# Altium schematic sheet Strathim MCU Pin Plan.SchDoc
size A3
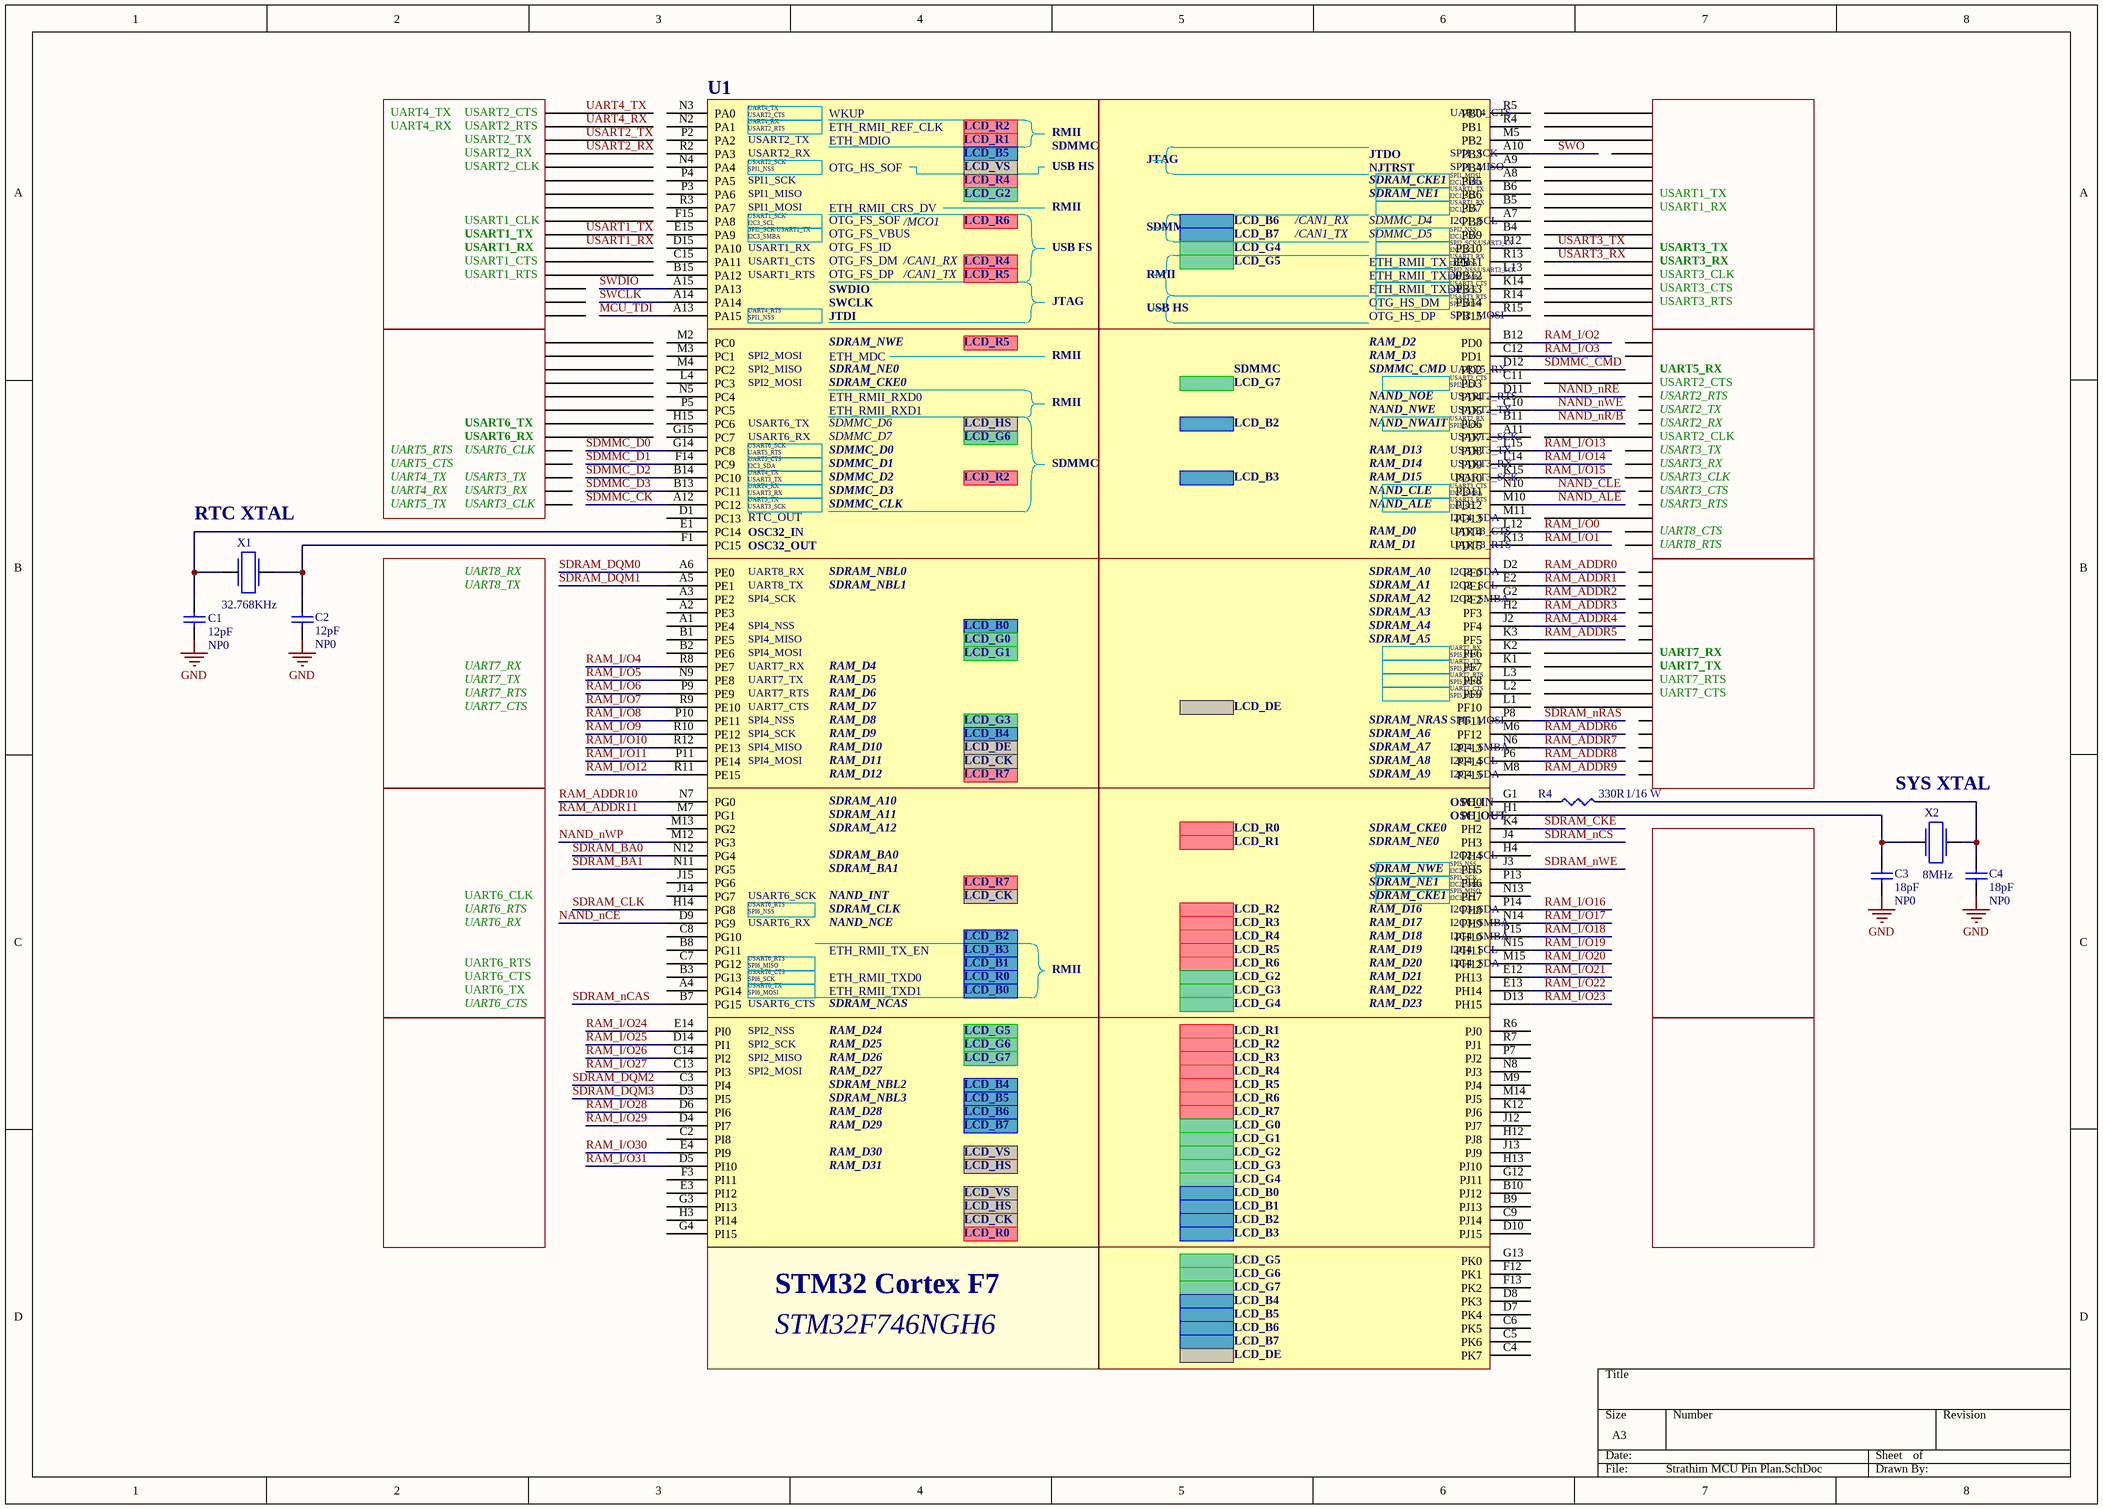
[diagram p0: Strathim MCU Pin Plan.SchDoc]

## Parts
C1  value 12pF  Type: NP0  [CAP0402]  (hidden comment: ChipCap 12 NP0)
C2  value 12pF  Type: NP0  [CAP0402]  (hidden comment: ChipCap 12 NP0)
C3  value 18pF  Type: NP0  [CAP0402]  (hidden comment: ChipCap 18 NP0)
C4  value 18pF  Type: NP0  [CAP0402]  (hidden comment: ChipCap 18 NP0)
R4  value 330R  Rating: 1/16 W  [RES0402]  (hidden comment: RES0402 330R 1%)
U1  STM32F746NGH6  [TFBGA216]  (value not drawn)  (parts A,B,C,D,E,F,G,H,I,J,K of 12)
X1  value 32.768KHz  [KX-327NHT]  (hidden comment: XTAL)
X2  value 8MHz  [ABM3 Ceramic Crystal]  (hidden comment: XTAL)

## Nets
GND: C1.1 C2.1 C3.1 C4.1
MCU_TDI: U1.A13(PA15)
NAND_ALE: U1.M10(PD12)
NAND_CLE: U1.N10(PD11)
NAND_nCE: U1.D9(PG9)
NAND_nR/B: U1.B11(PD6)
NAND_nRE: U1.D11(PD4)
NAND_nWE: U1.C10(PD5)
NAND_nWP: U1.M12(PG3)
RAM_ADDR0: U1.D2(PF0)
RAM_ADDR1: U1.E2(PF1)
RAM_ADDR2: U1.G2(PF2)
RAM_ADDR3: U1.H2(PF3)
RAM_ADDR4: U1.J2(PF4)
RAM_ADDR5: U1.K3(PF5)
RAM_ADDR6: U1.M6(PF12)
RAM_ADDR7: U1.N6(PF13)
RAM_ADDR8: U1.P6(PF14)
RAM_ADDR9: U1.M8(PF15)
RAM_ADDR10: U1.N7(PG0)
RAM_ADDR11: U1.M7(PG1)
RAM_I/O0: U1.L12(PD14)
RAM_I/O1: U1.K13(PD15)
RAM_I/O2: U1.B12(PD0)
RAM_I/O3: U1.C12(PD1)
RAM_I/O4: U1.R8(PE7)
RAM_I/O5: U1.N9(PE8)
RAM_I/O6: U1.P9(PE9)
RAM_I/O7: U1.R9(PE10)
RAM_I/O8: U1.P10(PE11)
RAM_I/O9: U1.R10(PE12)
RAM_I/O10: U1.R12(PE13)
RAM_I/O11: U1.P11(PE14)
RAM_I/O12: U1.R11(PE15)
RAM_I/O13: U1.L15(PD8)
RAM_I/O14: U1.L14(PD9)
RAM_I/O15: U1.K15(PD10)
RAM_I/O16: U1.P14(PH8)
RAM_I/O17: U1.N14(PH9)
RAM_I/O18: U1.P15(PH10)
RAM_I/O19: U1.N15(PH11)
RAM_I/O20: U1.M15(PH12)
RAM_I/O21: U1.E12(PH13)
RAM_I/O22: U1.E13(PH14)
RAM_I/O23: U1.D13(PH15)
RAM_I/O24: U1.E14(PI0)
RAM_I/O25: U1.D14(PI1)
RAM_I/O26: U1.C14(PI2)
RAM_I/O27: U1.C13(PI3)
RAM_I/O28: U1.D6(PI6)
RAM_I/O29: U1.D4(PI7)
RAM_I/O30: U1.E4(PI9)
RAM_I/O31: U1.D5(PI10)
SDMMC_CK: U1.A12(PC12)
SDMMC_CMD: U1.D12(PD2)
SDMMC_D0: U1.G14(PC8)
SDMMC_D1: U1.F14(PC9)
SDMMC_D2: U1.B14(PC10)
SDMMC_D3: U1.B13(PC11)
SDRAM_BA0: U1.N12(PG4)
SDRAM_BA1: U1.N11(PG5)
SDRAM_CKE: U1.K4(PH2)
SDRAM_CLK: U1.H14(PG8)
SDRAM_DQM0: U1.A6(PE0)
SDRAM_DQM1: U1.A5(PE1)
SDRAM_DQM2: U1.C3(PI4)
SDRAM_DQM3: U1.D3(PI5)
SDRAM_nCAS: U1.B7(PG15)
SDRAM_nCS: U1.J4(PH3)
SDRAM_nRAS: U1.P8(PF11)
SDRAM_nWE: U1.J3(PH5)
SWCLK: U1.A14(PA14)
SWDIO: U1.A15(PA13)
SWO: U1.A10(PB3)
NetC1_2: C1.2 U1.E1(PC14) X1.1
NetC2_2: C2.2 U1.F1(PC15) X1.2
NetC3_2: C3.2 U1.H1(PH1) X2.1
NetC4_2: C4.2 R4.2 X2.2
NetR4_1: R4.1 U1.G1(PH0)

Not connected (* = marked no-connect by the designer): U1 A1(PE4) A2(PE3) A3(PE2) A4(PG14) A7(PB8) A8(PB5) A9(PB4) A11(PD7) B1(PE5) B2(PE6) B3(PG13) B4(PB9) B5(PB7) B6(PB6) B8(PG11) B9(PJ13) B10(PJ12) B15(PA12) C2(PI8) C4(PK7) C5(PK6) C6(PK5) C7(PG12) C8(PG10) C9(PJ14) C11(PD3) C15(PA11) D1(PC13) D7(PK4) D8(PK3) D10(PJ15) D15(PA10) E3(PI12) E15(PA9) F3(PI11) F12(PK1) F13(PK2) F15(PA8) G3(PI13) G4(PI15) G12(PJ11) G13(PK0) G15(PC7) H3(PI14) H4(PH4) H12(PJ8) H13(PJ10) H15(PC6) J12(PJ7) J13(PJ9) J14(PG7) J15(PG6) K1(PF7) K2(PF6) K12(PJ6) K14(PB13) L1(PF10) L2(PF9) L3(PF8) L4(PC3) L13(PB12) M2(PC0) M3(PC1) M4(PC2) M5(PB2) M9(PJ4) M11(PD13) M13(PG2) M14(PJ5) N2(PA1) N3(PA0) N4(PA4) N5(PC4) N8(PJ3) N13(PH7) P2(PA2) P3(PA6) P4(PA5) P5(PC5) P7(PJ2) P12(PB10) P13(PH6) R2(PA3) R3(PA7) R4(PB1) R5(PB0) R6(PJ0) R7(PJ1) R13(PB11) R14(PB14) R15(PB15)

## Notes on the sheet
- (near U1) U1
- UART4_TX
- UART4_RX
- USART2_RTS
- USART2_CTS
- USART2_TX
- USART2_RX
- USART2_CLK
- USART1_CLK
- USART1_TX
- USART1_RX
- USART1_RTS
- USART1_CTS
- USART3_TX
- USART3_RX
- USART3_CLK
- USART3_CTS
- USART3_RTS
- UART5_RX
- UART5_RTS
- USART6_TX
- USART6_RX
- USART6_CLK
- UART5_TX
- UART5_CTS
- (near X1) RTC XTAL
- UART8_RX
- UART8_TX
- UART8_CTS
- UART8_RTS
- UART7_RX
- UART7_TX
- UART7_RTS
- UART7_CTS
- SYS XTAL
- UART6_RTS
- UART6_CLK
- UART6_RX
- UART6_CTS
- UART6_TX
- STM32 Cortex F7
- STM32F746NGH6
- Labels drawn without touching a wire or pin: UART4_RX, UART4_TX, USART1_RX, USART1_TX, USART2_RX, USART2_TX, USART3_RX, USART3_TX
- (in symbol STM32F746NGH6, part A) UART4_TX; WKUP; USART2_CTS; UART4_RX; ETH_RMII_REF_CLK; USART2_RTS; LCD_R2; ETH_MDIO; RMII; USART2_TX; LCD_R1; SDMMC; USART2_RX; LCD_B5; USART2_SCK; OTG_HS_SOF; SPI1_NSS; LCD_VS; USB HS; SPI1_SCK; LCD_R4; SPI1_MISO; LCD_G2; ETH_RMII_CRS_DV; SPI1_MOSI; USART1_SCK; /MCO1; I2C3_SCL; OTG_FS_SOF; LCD_R6; SPI2_SCK/USART1_TX; I2C3_SMBA; OTG_FS_VBUS; USART1_RX; OTG_FS_ID; USB FS; USART1_CTS; OTG_FS_DM; /CAN1_RX; USART1_RTS; OTG_FS_DP; /CAN1_TX; LCD_R5; SWDIO; SWCLK; JTAG; UART4_RTS; JTDI
- (in symbol STM32F746NGH6, part B) UART4_CTS; JTDO; SPI1_SCK; JTAG; NJTRST; SPI1_MISO; SPI1_MOSI; SDRAM_CKE1; I2C1_SMBA; USART1_TX; SDRAM_NE1; I2C1_SCL; USART1_RX; I2C1_SDA; LCD_B6; /CAN1_RX; SDMMC_D4; SDMMC; SPI2_NSS; LCD_B7; /CAN1_TX; SDMMC_D5; SPI2_SCK/USART3_TX; LCD_G4; I2C2_SCL; ETH_RMII_TX_EN; USART3_RX; LCD_G5; I2C2_SDA; ETH_RMII_TXD0; SPI2_NSS/USART3_SCK; RMII; I2C2_SMBA; ETH_RMII_TXD1; USART3_CTS; SPI2_SCK; OTG_HS_DM; USART3_RTS; SPI2_MISO; USB HS; OTG_HS_DP; SPI2_MOSI
- (in symbol STM32F746NGH6, part C) SDRAM_NWE; LCD_R5; ETH_MDC; SPI2_MOSI; RMII; SPI2_MISO; SDRAM_NE0; SDRAM_CKE0; ETH_RMII_RXD0; ETH_RMII_RXD1; USART6_TX; SDMMC_D6; LCD_HS; USART6_RX; SDMMC_D7; LCD_G6; USART6_SCK; UART5_RTS; SDMMC_D0; UART5_CTS; I2C3_SDA; SDMMC_D1; SDMMC; UART4_TX; USART3_TX; SDMMC_D2; LCD_R2; UART4_RX; USART3_RX; SDMMC_D3; UART5_TX; USART3_SCK; SDMMC_CLK; RTC_OUT; OSC32_IN; OSC32_OUT
- (in symbol STM32F746NGH6, part D) RAM_D2; RAM_D3; SDMMC; SDMMC_CMD; UART5_RX; USART2_CTS; LCD_G7; SPI2_SCK; NAND_NOE; USART2_RTS; NAND_NWE; USART2_TX; USART2_RX; LCD_B2; NAND_NWAIT; SPI3_MOSI; USART2_SCK; RAM_D13; USART3_TX; RAM_D14; USART3_RX; LCD_B3; RAM_D15; USART3_SCK; USART3_CTS; NAND_CLE; I2C4_SMBA; USART3_RTS; NAND_ALE; I2C4_SCL; I2C4_SDA; RAM_D0; UART8_CTS; RAM_D1; UART8_RTS
- (in symbol STM32F746NGH6, part E) UART8_RX; SDRAM_NBL0; UART8_TX; SDRAM_NBL1; SPI4_SCK; SPI4_NSS; LCD_B0; SPI4_MISO; LCD_G0; SPI4_MOSI; LCD_G1; UART7_RX; RAM_D4; UART7_TX; RAM_D5; UART7_RTS; RAM_D6; UART7_CTS; RAM_D7; RAM_D8; LCD_G3; RAM_D9; LCD_B4; RAM_D10; LCD_DE; RAM_D11; LCD_CK; RAM_D12; LCD_R7
- (in symbol STM32F746NGH6, part F) SDRAM_A0; I2C2_SDA; SDRAM_A1; I2C2_SCL; SDRAM_A2; I2C2_SMBA; SDRAM_A3; SDRAM_A4; SDRAM_A5; UART7_RX; SPI5_NSS; UART7_TX; SPI5_SCK; UART7_RTS; SPI5_MISO; UART7_CTS; SPI5_MOSI; LCD_DE; SDRAM_NRAS; SDRAM_A6; SDRAM_A7; I2C4_SMBA; SDRAM_A8; I2C4_SCL; SDRAM_A9; I2C4_SDA
- (in symbol STM32F746NGH6, part G) SDRAM_A10; SDRAM_A11; SDRAM_A12; SDRAM_BA0; SDRAM_BA1; LCD_R7; USART6_SCK; NAND_INT; LCD_CK; USART6_RTS; SPI6_NSS; SDRAM_CLK; USART6_RX; NAND_NCE; LCD_B2; ETH_RMII_TX_EN; LCD_B3; SPI6_MISO; LCD_B1; USART6_CTS; ETH_RMII_TXD0; RMII; SPI6_SCK; LCD_R0; USART6_TX; ETH_RMII_TXD1; SPI6_MOSI; LCD_B0; SDRAM_NCAS
- (in symbol STM32F746NGH6, part H) OSC_IN; OSC_OUT; LCD_R0; SDRAM_CKE0; LCD_R1; SDRAM_NE0; I2C2_SCL; SPI5_NSS; SDRAM_NWE; I2C2_SDA; SPI5_SCK; SDRAM_NE1; I2C2_SMBA; SPI5_MISO; SDRAM_CKE1; I2C3_SCL; LCD_R2; RAM_D16; I2C3_SDA; LCD_R3; RAM_D17; I2C3_SMBA; LCD_R4; RAM_D18; I2C4_SMBA; LCD_R5; RAM_D19; I2C4_SCL; LCD_R6; RAM_D20; I2C4_SDA; LCD_G2; RAM_D21; LCD_G3; RAM_D22; LCD_G4; RAM_D23
- (in symbol STM32F746NGH6, part I) SPI2_NSS; RAM_D24; LCD_G5; SPI2_SCK; RAM_D25; LCD_G6; SPI2_MISO; RAM_D26; LCD_G7; SPI2_MOSI; RAM_D27; SDRAM_NBL2; LCD_B4; SDRAM_NBL3; LCD_B5; RAM_D28; LCD_B6; RAM_D29; LCD_B7; RAM_D30; LCD_VS; RAM_D31; LCD_HS; LCD_CK; LCD_R0
- (in symbol STM32F746NGH6, part J) LCD_R1; LCD_R2; LCD_R3; LCD_R4; LCD_R5; LCD_R6; LCD_R7; LCD_G0; LCD_G1; LCD_G2; LCD_G3; LCD_G4; LCD_B0; LCD_B1; LCD_B2; LCD_B3
- (in symbol STM32F746NGH6, part K) LCD_G5; LCD_G6; LCD_G7; LCD_B4; LCD_B5; LCD_B6; LCD_B7; LCD_DE

## Library data of the parts
C1 C2 = ChipCap 12 NP0: Surface-mount ceramic multilayer capacitor; Manufacturer: YAGEO; Voltage: 100V; Tolerance: 0.1pF; ComponentLink1Description: Datasheet; ComponentLink1URL: http://www.deaha.com/pdf/YAGEO-CC_series.pdf
C3 C4 = ChipCap 18 NP0: Surface-mount ceramic multilayer capacitor; Manufacturer: YAGEO; Voltage: 100V; Tolerance: 0.1pF; ComponentLink1Description: Datasheet; ComponentLink1URL: http://www.deaha.com/pdf/YAGEO-CC_series.pdf
R4 = RES0402 330R 1%: Think Film Chip resistor; Manufacturer Part Number: RC0402FR-07330RL (YAG); Temperature Coefficient: 100ppm/K; Tolerance: 1%; Type: ThickFilm
U1 = STM32F746NGH6: ARM Cortex M7, 462DMIPS, 1MB Flash
X1 = Crystall oscillator: Quartz crystall oscillator
X2 = ABM3 Ceramic SMD Crystal: Quartz crystall oscillator